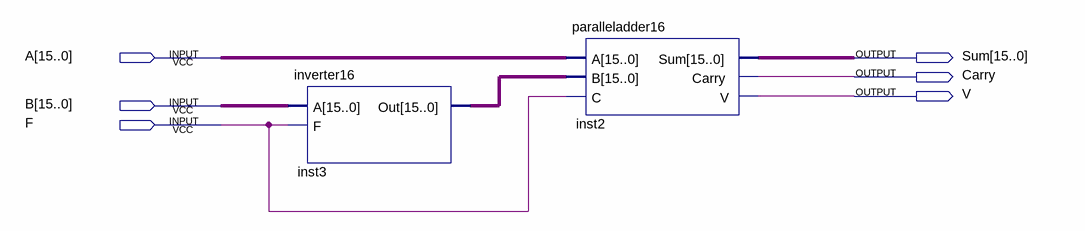
[diagram p0: schematic sheet]
// Quartus schematic paralleladder16withsub.bdf as structural Verilog: 2 symbols, 6 pins
module paralleladder16withsub (
  input  [15:0] A,
  input  [15:0] B,
  input  F,
  output [15:0] Sum,
  output Carry,
  output V
);

  wire [15:0] inst3_out;

  inverter16 inst3 (.A(B), .F(F), .Out(inst3_out));
  paralleladder16 inst2 (.A(A), .B(inst3_out), .C(F), .Sum(Sum), .Carry(Carry), .V(V));
endmodule
